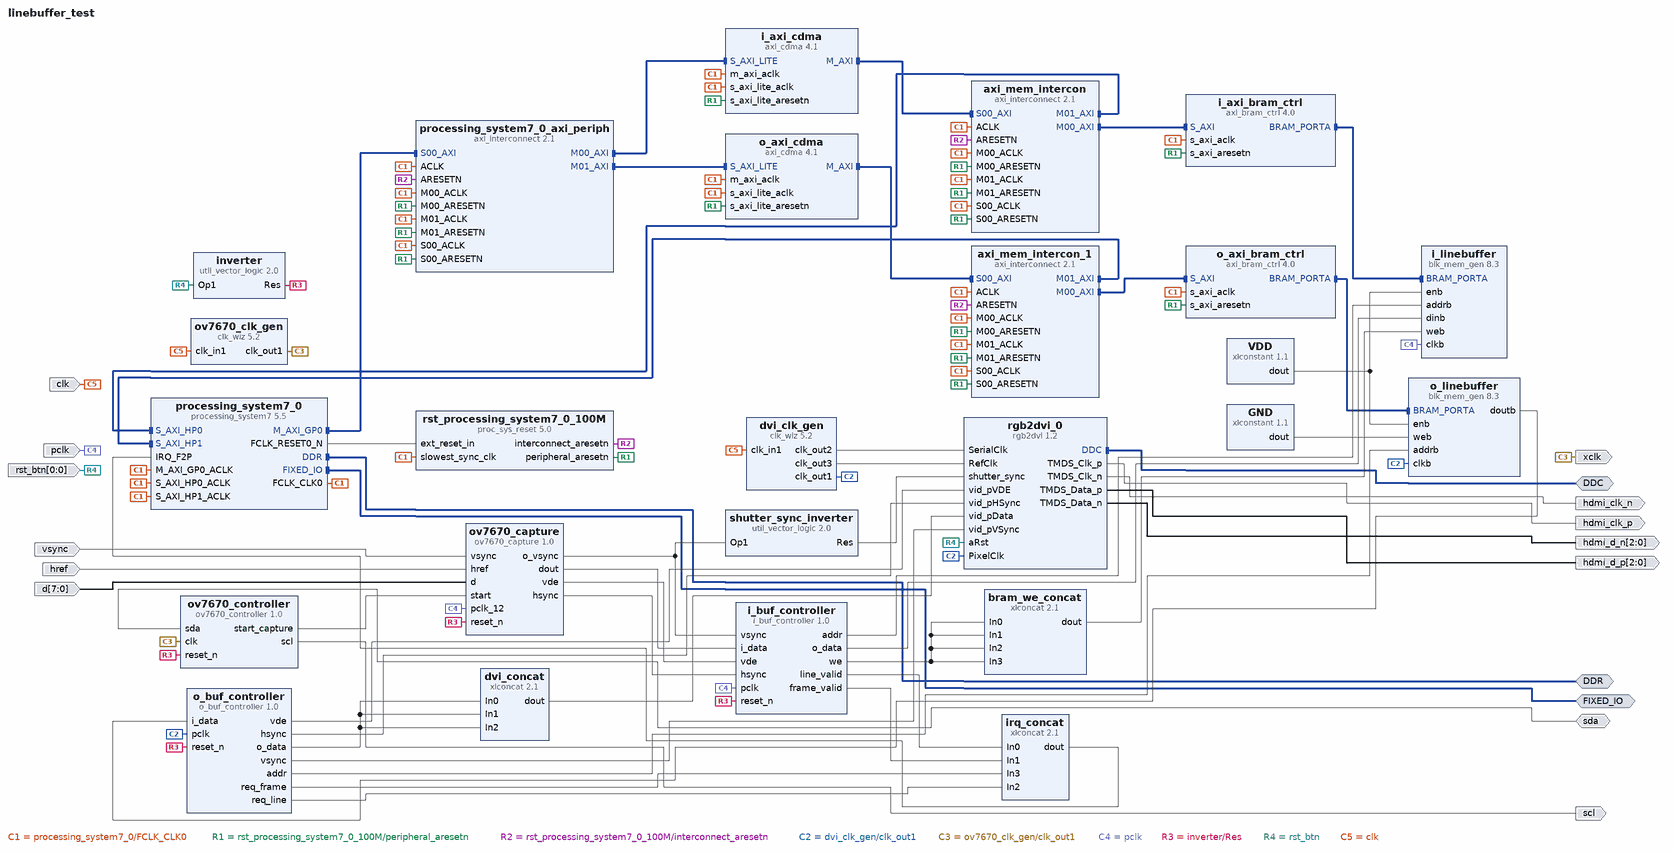
[diagram p0: block diagram of the top level]
# Vivado block design linebuffer_test, Vivado 2015.4
create_bd_design linebuffer_test

create_bd_intf_port -mode Master -vlnv xilinx.com:interface:ddrx_rtl:1.0 DDR
create_bd_intf_port -mode Master -vlnv xilinx.com:display_processing_system7:fixedio_rtl:1.0 FIXED_IO
create_bd_intf_port -mode Master -vlnv xilinx.com:interface:iic_rtl:1.0 DDC
create_bd_port -dir O hdmi_clk_p
create_bd_port -dir O hdmi_clk_n
create_bd_port -dir O -from 2 -to 0 hdmi_d_p
create_bd_port -dir O -from 2 -to 0 hdmi_d_n
create_bd_port -dir O xclk
create_bd_port -dir I vsync
create_bd_port -dir IO sda
create_bd_port -dir O scl
create_bd_port -dir I href
create_bd_port -dir I pclk
create_bd_port -dir I -from 7 -to 0 d
create_bd_port -dir I -from 0 -to 0 rst_btn
create_bd_port -dir I -type clk clk
set_property -dict {CONFIG.FREQ_HZ 125000000} [get_bd_ports clk]

create_bd_cell -type ip -vlnv xilinx.com:ip:axi_interconnect:2.1 processing_system7_0_axi_periph
set_property -dict {CONFIG.NUM_MI 2} [get_bd_cells processing_system7_0_axi_periph]
create_bd_cell -type ip -vlnv xilinx.com:ip:axi_interconnect:2.1 axi_mem_intercon
set_property -dict {CONFIG.NUM_MI 2} [get_bd_cells axi_mem_intercon]
create_bd_cell -type ip -vlnv xilinx.com:ip:blk_mem_gen:8.3 o_linebuffer
set_property -dict [list \
  CONFIG.Memory_Type True_Dual_Port_RAM \
  CONFIG.Enable_32bit_Address true \
  CONFIG.Write_Depth_A 8192 \
  CONFIG.Enable_B Use_ENB_Pin \
  CONFIG.Register_PortA_Output_of_Memory_Primitives false \
  CONFIG.Register_PortB_Output_of_Memory_Primitives false \
  CONFIG.Use_RSTA_Pin true \
  CONFIG.Use_RSTB_Pin true \
  CONFIG.Port_B_Clock 100 \
  CONFIG.Port_B_Write_Rate 50 \
  CONFIG.Port_B_Enable_Rate 100 \
  CONFIG.use_bram_block BRAM_Controller \
] [get_bd_cells o_linebuffer]
create_bd_cell -type ip -vlnv xilinx.com:ip:axi_bram_ctrl:4.0 o_axi_bram_ctrl
set_property -dict {CONFIG.SINGLE_PORT_BRAM 1} [get_bd_cells o_axi_bram_ctrl]
create_bd_cell -type ip -vlnv xilinx.com:ip:axi_cdma:4.1 o_axi_cdma
set_property -dict {CONFIG.C_M_AXI_MAX_BURST_LEN 256 CONFIG.C_INCLUDE_SG 0} [get_bd_cells o_axi_cdma]
create_bd_cell -type ip -vlnv xilinx.com:ip:axi_interconnect:2.1 axi_mem_intercon_1
set_property -dict {CONFIG.NUM_MI 2} [get_bd_cells axi_mem_intercon_1]
create_bd_cell -type ip -vlnv xilinx.com:ip:xlconstant:1.1 GND
set_property -dict {CONFIG.CONST_WIDTH 4 CONFIG.CONST_VAL 0} [get_bd_cells GND]
create_bd_cell -type ip -vlnv xilinx.com:ip:blk_mem_gen:8.3 i_linebuffer
set_property -dict [list \
  CONFIG.Memory_Type True_Dual_Port_RAM \
  CONFIG.Enable_32bit_Address true \
  CONFIG.Write_Depth_A 8192 \
  CONFIG.Enable_B Use_ENB_Pin \
  CONFIG.Register_PortA_Output_of_Memory_Primitives false \
  CONFIG.Use_RSTA_Pin true \
  CONFIG.Use_RSTB_Pin true \
  CONFIG.Port_B_Clock 100 \
  CONFIG.Port_B_Write_Rate 50 \
  CONFIG.Port_B_Enable_Rate 100 \
  CONFIG.use_bram_block BRAM_Controller \
] [get_bd_cells i_linebuffer]
create_bd_cell -type ip -vlnv xilinx.com:ip:axi_cdma:4.1 i_axi_cdma
set_property -dict {CONFIG.C_M_AXI_MAX_BURST_LEN 256 CONFIG.C_INCLUDE_SG 0} [get_bd_cells i_axi_cdma]
create_bd_cell -type ip -vlnv xilinx.com:ip:axi_bram_ctrl:4.0 i_axi_bram_ctrl
set_property -dict {CONFIG.SINGLE_PORT_BRAM 1} [get_bd_cells i_axi_bram_ctrl]
create_bd_cell -type ip -vlnv xilinx.com:ip:xlconcat:2.1 bram_we_concat
set_property -dict {CONFIG.NUM_PORTS 4} [get_bd_cells bram_we_concat]
create_bd_cell -type ip -vlnv xilinx.com:ip:xlconcat:2.1 irq_concat
set_property -dict {CONFIG.NUM_PORTS 4} [get_bd_cells irq_concat]
create_bd_cell -type ip -vlnv xilinx.com:ip:clk_wiz:5.2 ov7670_clk_gen
set_property -dict [list \
  CONFIG.PRIMITIVE PLL \
  CONFIG.USE_INCLK_SWITCHOVER false \
  CONFIG.SECONDARY_SOURCE Single_ended_clock_capable_pin \
  CONFIG.CLKIN2_JITTER_PS 146.42 \
  CONFIG.CLKOUT2_USED false \
  CONFIG.NUM_OUT_CLKS 1 \
  CONFIG.CLKOUT1_REQUESTED_OUT_FREQ 24 \
  CONFIG.CLKOUT2_REQUESTED_OUT_FREQ 100.000 \
  CONFIG.CLKOUT1_DRIVES BUFG \
  CONFIG.CLKOUT2_DRIVES BUFG \
  CONFIG.CLKOUT3_DRIVES BUFG \
  CONFIG.CLKOUT4_DRIVES BUFG \
  CONFIG.CLKOUT5_DRIVES BUFG \
  CONFIG.CLKOUT6_DRIVES BUFG \
  CONFIG.CLKOUT7_DRIVES BUFG \
  CONFIG.MMCM_DIVCLK_DIVIDE 5 \
  CONFIG.MMCM_CLKFBOUT_MULT_F 48 \
  CONFIG.MMCM_CLKIN2_PERIOD 10.0 \
  CONFIG.MMCM_COMPENSATION ZHOLD \
  CONFIG.MMCM_CLKOUT0_DIVIDE_F 50 \
  CONFIG.MMCM_CLKOUT1_DIVIDE 1 \
  CONFIG.CLKOUT1_JITTER 219.904 \
  CONFIG.CLKOUT1_PHASE_ERROR 222.305 \
  CONFIG.CLKOUT2_JITTER 317.841 \
  CONFIG.CLKOUT2_PHASE_ERROR 249.865 \
] [get_bd_cells ov7670_clk_gen]
create_bd_cell -type ip -vlnv xilinx.com:ip:clk_wiz:5.2 dvi_clk_gen
set_property -dict [list \
  CONFIG.CLKOUT2_USED true \
  CONFIG.CLKOUT3_USED true \
  CONFIG.NUM_OUT_CLKS 3 \
  CONFIG.CLKOUT1_REQUESTED_OUT_FREQ 60 \
  CONFIG.CLKOUT2_REQUESTED_OUT_FREQ 300 \
  CONFIG.CLKOUT3_REQUESTED_OUT_FREQ 200 \
  CONFIG.MMCM_DIVCLK_DIVIDE 5 \
  CONFIG.MMCM_CLKFBOUT_MULT_F 24.000 \
  CONFIG.MMCM_CLKOUT0_DIVIDE_F 10.000 \
  CONFIG.MMCM_CLKOUT1_DIVIDE 2 \
  CONFIG.MMCM_CLKOUT2_DIVIDE 3 \
  CONFIG.CLKOUT1_JITTER 348.653 \
  CONFIG.CLKOUT1_PHASE_ERROR 335.459 \
  CONFIG.CLKOUT2_JITTER 257.081 \
  CONFIG.CLKOUT2_PHASE_ERROR 335.459 \
  CONFIG.CLKOUT3_JITTER 275.885 \
  CONFIG.CLKOUT3_PHASE_ERROR 335.459 \
] [get_bd_cells dvi_clk_gen]
create_bd_cell -type ip -vlnv xilinx.com:ip:processing_system7:5.5 processing_system7_0
set_property -dict [list \
  CONFIG.PCW_UIPARAM_DDR_FREQ_MHZ 525 \
  CONFIG.PCW_CRYSTAL_PERIPHERAL_FREQMHZ 50.000000 \
  CONFIG.PCW_APU_PERIPHERAL_FREQMHZ 650 \
  CONFIG.PCW_SDIO_PERIPHERAL_FREQMHZ 50 \
  CONFIG.PCW_FPGA0_PERIPHERAL_FREQMHZ 100 \
  CONFIG.PCW_USE_S_AXI_HP0 1 \
  CONFIG.PCW_USE_S_AXI_HP1 1 \
  CONFIG.PCW_USE_FABRIC_INTERRUPT 1 \
  CONFIG.PCW_IRQ_F2P_INTR 1 \
  CONFIG.PCW_PRESET_BANK1_VOLTAGE {LVCMOS 1.8V} \
  CONFIG.PCW_UIPARAM_DDR_PARTNO {MT41K128M16 JT-125} \
  CONFIG.PCW_QSPI_PERIPHERAL_ENABLE 1 \
  CONFIG.PCW_QSPI_GRP_SINGLE_SS_ENABLE 1 \
  CONFIG.PCW_QSPI_GRP_FBCLK_ENABLE 1 \
  CONFIG.PCW_ENET0_PERIPHERAL_ENABLE 1 \
  CONFIG.PCW_ENET0_ENET0_IO {MIO 16 .. 27} \
  CONFIG.PCW_ENET0_GRP_MDIO_ENABLE 1 \
  CONFIG.PCW_ENET0_RESET_ENABLE 0 \
  CONFIG.PCW_SD0_PERIPHERAL_ENABLE 1 \
  CONFIG.PCW_SD0_GRP_CD_ENABLE 1 \
  CONFIG.PCW_SD0_GRP_CD_IO {MIO 47} \
  CONFIG.PCW_SD0_GRP_WP_ENABLE 1 \
  CONFIG.PCW_UART1_PERIPHERAL_ENABLE 1 \
  CONFIG.PCW_TTC0_PERIPHERAL_ENABLE 1 \
  CONFIG.PCW_USB0_PERIPHERAL_ENABLE 1 \
  CONFIG.PCW_USB0_RESET_ENABLE 1 \
  CONFIG.PCW_USB0_RESET_IO {MIO 46} \
  CONFIG.PCW_GPIO_MIO_GPIO_ENABLE 1 \
] [get_bd_cells processing_system7_0]
# 105 more settings of processing_system7_0 are not shown: defaults, MIO pin electricals, DDR timing, and values the tool derives
create_bd_cell -type ip -vlnv xilinx.com:ip:proc_sys_reset:5.0 rst_processing_system7_0_100M
create_bd_cell -type ip -vlnv mikeanthonywild.com:user:ov7670_controller:1.0 ov7670_controller
create_bd_cell -type ip -vlnv xilinx.com:ip:util_vector_logic:2.0 inverter
set_property -dict {CONFIG.C_SIZE 1 CONFIG.C_OPERATION not} [get_bd_cells inverter]
create_bd_cell -type ip -vlnv xilinx.com:ip:xlconcat:2.1 dvi_concat
set_property -dict {CONFIG.NUM_PORTS 3} [get_bd_cells dvi_concat]
create_bd_cell -type ip -vlnv xilinx.com:ip:xlconstant:1.1 VDD
create_bd_cell -type ip -vlnv mikeanthonywild.com:user:ov7670_capture:1.0 ov7670_capture
create_bd_cell -type ip -vlnv digilentinc.com:ip:rgb2dvi:1.2 rgb2dvi_0
set_property -dict [list \
  CONFIG.kGenerateSerialClk false \
  CONFIG.kESIDFile c:/Users/Mike/Documents/osiris-hdl/ESID/ov7670/ov7670.txt \
] [get_bd_cells rgb2dvi_0]
create_bd_cell -type ip -vlnv mikeanthonywild.com:user:o_buf_controller:1.0 o_buf_controller
set_property -dict {CONFIG.V_FRONT_PORCH 10 CONFIG.V_SYNC_PULSE 2 CONFIG.V_BACK_PORCH 33} [get_bd_cells o_buf_controller]
create_bd_cell -type ip -vlnv mikeanthonywild.com:user:i_buf_controller:1.0 i_buf_controller
create_bd_cell -type ip -vlnv xilinx.com:ip:util_vector_logic:2.0 shutter_sync_inverter
set_property -dict {CONFIG.C_SIZE 1 CONFIG.C_OPERATION not} [get_bd_cells shutter_sync_inverter]

# ---- connections ----

connect_bd_intf_net [get_bd_intf_pins processing_system7_0/M_AXI_GP0] [get_bd_intf_pins processing_system7_0_axi_periph/S00_AXI]
connect_bd_intf_net [get_bd_intf_pins o_axi_cdma/M_AXI] [get_bd_intf_pins axi_mem_intercon_1/S00_AXI]
connect_bd_intf_net [get_bd_intf_pins axi_mem_intercon_1/M00_AXI] [get_bd_intf_pins o_axi_bram_ctrl/S_AXI]
connect_bd_intf_net [get_bd_intf_pins processing_system7_0_axi_periph/M01_AXI] [get_bd_intf_pins o_axi_cdma/S_AXI_LITE]
connect_bd_intf_net [get_bd_intf_pins axi_mem_intercon/M01_AXI] [get_bd_intf_pins processing_system7_0/S_AXI_HP0]
connect_bd_intf_net [get_bd_intf_pins axi_mem_intercon_1/M01_AXI] [get_bd_intf_pins processing_system7_0/S_AXI_HP1]
connect_bd_intf_net [get_bd_intf_pins o_linebuffer/BRAM_PORTA] [get_bd_intf_pins o_axi_bram_ctrl/BRAM_PORTA]
connect_bd_intf_net [get_bd_intf_pins i_axi_cdma/M_AXI] [get_bd_intf_pins axi_mem_intercon/S00_AXI]
connect_bd_intf_net [get_bd_intf_pins processing_system7_0_axi_periph/M00_AXI] [get_bd_intf_pins i_axi_cdma/S_AXI_LITE]
connect_bd_intf_net [get_bd_intf_pins axi_mem_intercon/M00_AXI] [get_bd_intf_pins i_axi_bram_ctrl/S_AXI]
connect_bd_intf_net [get_bd_intf_pins i_linebuffer/BRAM_PORTA] [get_bd_intf_pins i_axi_bram_ctrl/BRAM_PORTA]
connect_bd_intf_net [get_bd_intf_ports DDR] [get_bd_intf_pins processing_system7_0/DDR]
connect_bd_intf_net [get_bd_intf_ports FIXED_IO] [get_bd_intf_pins processing_system7_0/FIXED_IO]
connect_bd_intf_net [get_bd_intf_ports DDC] [get_bd_intf_pins rgb2dvi_0/DDC]
connect_bd_net [get_bd_pins processing_system7_0/FCLK_CLK0] \
  [get_bd_pins o_axi_cdma/m_axi_aclk] [get_bd_pins o_axi_bram_ctrl/s_axi_aclk] [get_bd_pins o_axi_cdma/s_axi_lite_aclk] \
  [get_bd_pins i_axi_cdma/m_axi_aclk] [get_bd_pins i_axi_cdma/s_axi_lite_aclk] [get_bd_pins i_axi_bram_ctrl/s_axi_aclk] \
  [get_bd_pins processing_system7_0/M_AXI_GP0_ACLK] [get_bd_pins processing_system7_0/S_AXI_HP0_ACLK] \
  [get_bd_pins processing_system7_0/S_AXI_HP1_ACLK] [get_bd_pins rst_processing_system7_0_100M/slowest_sync_clk] \
  [get_bd_pins processing_system7_0_axi_periph/S00_ACLK] [get_bd_pins processing_system7_0_axi_periph/ACLK] \
  [get_bd_pins processing_system7_0_axi_periph/M00_ACLK] [get_bd_pins axi_mem_intercon/S00_ACLK] \
  [get_bd_pins axi_mem_intercon/ACLK] [get_bd_pins axi_mem_intercon/M00_ACLK] [get_bd_pins axi_mem_intercon_1/S00_ACLK] \
  [get_bd_pins axi_mem_intercon_1/ACLK] [get_bd_pins axi_mem_intercon_1/M00_ACLK] \
  [get_bd_pins processing_system7_0_axi_periph/M01_ACLK] [get_bd_pins axi_mem_intercon/M01_ACLK] \
  [get_bd_pins axi_mem_intercon_1/M01_ACLK]
connect_bd_net [get_bd_pins processing_system7_0/FCLK_RESET0_N] [get_bd_pins rst_processing_system7_0_100M/ext_reset_in]
connect_bd_net [get_bd_pins rst_processing_system7_0_100M/peripheral_aresetn] \
  [get_bd_pins o_axi_bram_ctrl/s_axi_aresetn] [get_bd_pins o_axi_cdma/s_axi_lite_aresetn] \
  [get_bd_pins i_axi_cdma/s_axi_lite_aresetn] [get_bd_pins i_axi_bram_ctrl/s_axi_aresetn] \
  [get_bd_pins processing_system7_0_axi_periph/S00_ARESETN] [get_bd_pins processing_system7_0_axi_periph/M00_ARESETN] \
  [get_bd_pins axi_mem_intercon/S00_ARESETN] [get_bd_pins axi_mem_intercon/M00_ARESETN] \
  [get_bd_pins axi_mem_intercon_1/S00_ARESETN] [get_bd_pins axi_mem_intercon_1/M00_ARESETN] \
  [get_bd_pins processing_system7_0_axi_periph/M01_ARESETN] [get_bd_pins axi_mem_intercon/M01_ARESETN] \
  [get_bd_pins axi_mem_intercon_1/M01_ARESETN]
connect_bd_net [get_bd_pins rst_processing_system7_0_100M/interconnect_aresetn] \
  [get_bd_pins processing_system7_0_axi_periph/ARESETN] [get_bd_pins axi_mem_intercon/ARESETN] \
  [get_bd_pins axi_mem_intercon_1/ARESETN]
connect_bd_net [get_bd_pins o_linebuffer/doutb] [get_bd_pins o_buf_controller/i_data]
connect_bd_net [get_bd_pins o_buf_controller/addr] [get_bd_pins o_linebuffer/addrb]
connect_bd_net [get_bd_pins GND/dout] [get_bd_pins o_linebuffer/web]
connect_bd_net -net i_buf_controller_0_we [get_bd_pins i_buf_controller/we] \
  [get_bd_pins bram_we_concat/In0] [get_bd_pins bram_we_concat/In1] [get_bd_pins bram_we_concat/In2] \
  [get_bd_pins bram_we_concat/In3]
connect_bd_net [get_bd_pins bram_we_concat/dout] [get_bd_pins i_linebuffer/web]
connect_bd_net -net i_buf_controller_0_addr [get_bd_pins i_buf_controller/addr] [get_bd_pins i_linebuffer/addrb]
connect_bd_net -net i_buf_controller_0_o_data [get_bd_pins i_buf_controller/o_data] [get_bd_pins i_linebuffer/dinb]
connect_bd_net [get_bd_pins irq_concat/dout] [get_bd_pins processing_system7_0/IRQ_F2P]
connect_bd_net [get_bd_pins o_buf_controller/req_frame] [get_bd_pins irq_concat/In3]
connect_bd_net [get_bd_pins o_buf_controller/req_line] [get_bd_pins irq_concat/In2]
connect_bd_net -net clk_wiz_0_clk_out2 [get_bd_pins dvi_clk_gen/clk_out1] \
  [get_bd_pins o_linebuffer/clkb] [get_bd_pins rgb2dvi_0/PixelClk] [get_bd_pins o_buf_controller/pclk]
connect_bd_net [get_bd_pins rgb2dvi_0/TMDS_Clk_p] [get_bd_ports hdmi_clk_p]
connect_bd_net [get_bd_pins rgb2dvi_0/TMDS_Clk_n] [get_bd_ports hdmi_clk_n]
connect_bd_net [get_bd_pins rgb2dvi_0/TMDS_Data_p] [get_bd_ports hdmi_d_p]
connect_bd_net [get_bd_pins rgb2dvi_0/TMDS_Data_n] [get_bd_ports hdmi_d_n]
connect_bd_net [get_bd_pins dvi_clk_gen/clk_out2] [get_bd_pins rgb2dvi_0/SerialClk]
connect_bd_net -net ov7670_controller_0_start_capture [get_bd_pins ov7670_controller/start_capture] [get_bd_pins ov7670_capture/start]
connect_bd_net -net ov7670_capture_0_dout [get_bd_pins ov7670_capture/dout] [get_bd_pins i_buf_controller/i_data]
connect_bd_net -net ov7670_capture_0_vde [get_bd_pins ov7670_capture/vde] [get_bd_pins i_buf_controller/vde]
connect_bd_net -net ov7670_capture_0_hsync [get_bd_pins ov7670_capture/hsync] [get_bd_pins i_buf_controller/hsync]
connect_bd_net [get_bd_pins ov7670_clk_gen/clk_out1] [get_bd_ports xclk] [get_bd_pins ov7670_controller/clk]
connect_bd_net [get_bd_pins i_buf_controller/line_valid] [get_bd_pins irq_concat/In0]
connect_bd_net [get_bd_pins i_buf_controller/frame_valid] [get_bd_pins irq_concat/In1]
connect_bd_net [get_bd_pins ov7670_capture/o_vsync] [get_bd_pins i_buf_controller/vsync] [get_bd_pins shutter_sync_inverter/Op1]
connect_bd_net [get_bd_ports vsync] [get_bd_pins ov7670_capture/vsync]
connect_bd_net [get_bd_ports sda] [get_bd_pins ov7670_controller/sda]
connect_bd_net [get_bd_pins ov7670_controller/scl] [get_bd_ports scl]
connect_bd_net [get_bd_ports href] [get_bd_pins ov7670_capture/href]
connect_bd_net [get_bd_ports pclk] [get_bd_pins i_linebuffer/clkb] [get_bd_pins ov7670_capture/pclk_12] [get_bd_pins i_buf_controller/pclk]
connect_bd_net [get_bd_ports d] [get_bd_pins ov7670_capture/d]
connect_bd_net -net util_vector_logic_0_Res [get_bd_pins inverter/Res] \
  [get_bd_pins ov7670_controller/reset_n] [get_bd_pins ov7670_capture/reset_n] [get_bd_pins o_buf_controller/reset_n] \
  [get_bd_pins i_buf_controller/reset_n]
connect_bd_net [get_bd_pins dvi_concat/dout] [get_bd_pins rgb2dvi_0/vid_pData]
connect_bd_net [get_bd_pins VDD/dout] [get_bd_pins o_linebuffer/enb] [get_bd_pins i_linebuffer/enb]
connect_bd_net [get_bd_ports rst_btn] [get_bd_pins inverter/Op1] [get_bd_pins rgb2dvi_0/aRst]
connect_bd_net [get_bd_pins o_buf_controller/o_data] [get_bd_pins dvi_concat/In0] [get_bd_pins dvi_concat/In1] [get_bd_pins dvi_concat/In2]
connect_bd_net [get_bd_pins o_buf_controller/vde] [get_bd_pins rgb2dvi_0/vid_pVDE]
connect_bd_net [get_bd_pins o_buf_controller/hsync] [get_bd_pins rgb2dvi_0/vid_pHSync]
connect_bd_net [get_bd_pins o_buf_controller/vsync] [get_bd_pins rgb2dvi_0/vid_pVSync]
connect_bd_net [get_bd_ports clk] [get_bd_pins ov7670_clk_gen/clk_in1] [get_bd_pins dvi_clk_gen/clk_in1]
connect_bd_net [get_bd_pins dvi_clk_gen/clk_out3] [get_bd_pins rgb2dvi_0/RefClk]
connect_bd_net [get_bd_pins shutter_sync_inverter/Res] [get_bd_pins rgb2dvi_0/shutter_sync]

# ---- address map ----
assign_bd_address -offset 0x00000000 -range 512M -target_address_space [get_bd_addr_spaces i_axi_cdma/Data] [get_bd_addr_segs processing_system7_0/S_AXI_HP0/HP0_DDR_LOWOCM]
assign_bd_address -offset 0xC0000000 -range 4K -target_address_space [get_bd_addr_spaces i_axi_cdma/Data] [get_bd_addr_segs i_axi_bram_ctrl/S_AXI/Mem0]
assign_bd_address -offset 0x00000000 -range 512M -target_address_space [get_bd_addr_spaces o_axi_cdma/Data] [get_bd_addr_segs processing_system7_0/S_AXI_HP1/HP1_DDR_LOWOCM]
assign_bd_address -offset 0xC0001000 -range 4K -target_address_space [get_bd_addr_spaces o_axi_cdma/Data] [get_bd_addr_segs o_axi_bram_ctrl/S_AXI/Mem0]
assign_bd_address -offset 0x7E200000 -range 64K -target_address_space [get_bd_addr_spaces processing_system7_0/Data] [get_bd_addr_segs i_axi_cdma/S_AXI_LITE/Reg]
assign_bd_address -offset 0x7E210000 -range 64K -target_address_space [get_bd_addr_spaces processing_system7_0/Data] [get_bd_addr_segs o_axi_cdma/S_AXI_LITE/Reg]

validate_bd_design
save_bd_design
